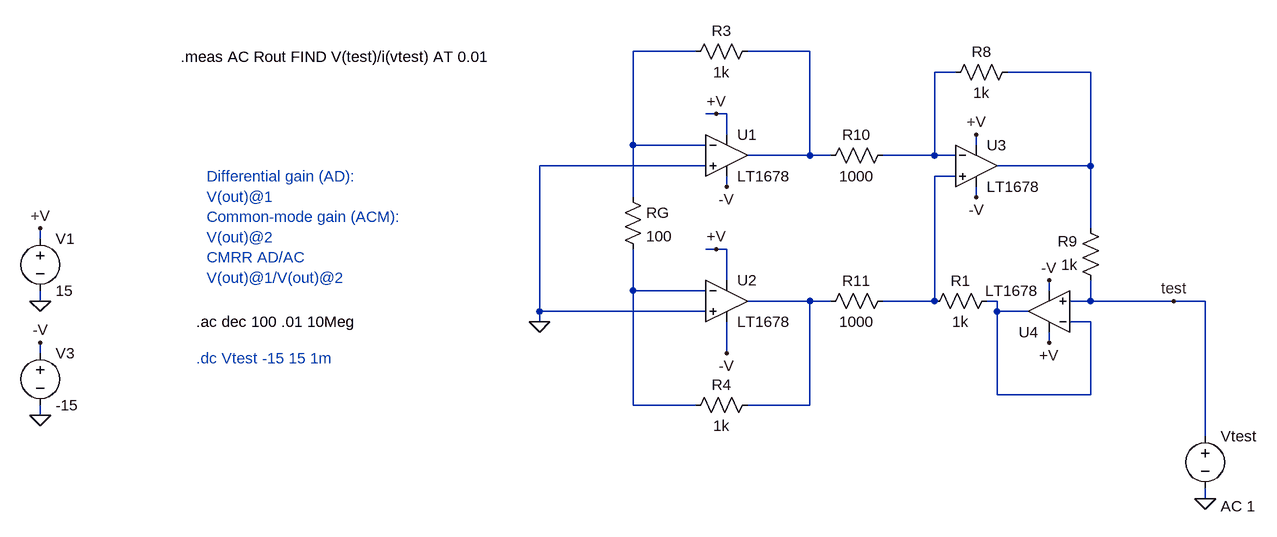
[diagram p0: schematic AI_VI_Buffer_Rout.asc]
AI_VI_Buffer_Rout.asc, the LTspice schematic file:
Version 4
SHEET 1 2004 1572
WIRE 416 48 320 48
WIRE 592 48 496 48
WIRE 816 80 784 80
WIRE 1024 80 896 80
WIRE 448 144 432 144
WIRE 464 144 448 144
WIRE 464 176 464 144
WIRE 320 192 320 48
WIRE 432 192 320 192
WIRE 848 192 848 176
WIRE 592 208 592 48
WIRE 592 208 496 208
WIRE 624 208 592 208
WIRE 784 208 784 80
WIRE 784 208 704 208
WIRE 816 208 784 208
WIRE 432 224 176 224
WIRE 1024 224 1024 80
WIRE 1024 224 880 224
WIRE 816 240 784 240
WIRE 464 256 464 240
WIRE 320 272 320 192
WIRE 848 272 848 256
WIRE 1024 320 1024 224
WIRE -592 336 -592 320
WIRE 448 352 432 352
WIRE 464 352 448 352
WIRE 464 400 464 352
WIRE 320 416 320 352
WIRE 432 416 320 416
WIRE 960 416 960 400
WIRE -592 432 -592 416
WIRE 592 432 496 432
WIRE 624 432 592 432
WIRE 784 432 784 240
WIRE 784 432 704 432
WIRE 880 432 864 432
WIRE 1024 432 1024 400
WIRE 1024 432 992 432
WIRE 1152 432 1024 432
WIRE 1200 432 1152 432
WIRE 176 448 176 224
WIRE 432 448 176 448
WIRE 880 448 880 432
WIRE 928 448 880 448
WIRE 176 464 176 448
WIRE 1024 464 992 464
WIRE 960 496 960 480
WIRE -592 512 -592 496
WIRE 464 512 464 464
WIRE 880 576 880 448
WIRE 1024 576 1024 464
WIRE 1024 576 880 576
WIRE 320 592 320 416
WIRE 416 592 320 592
WIRE 592 592 592 432
WIRE 592 592 496 592
WIRE -592 608 -592 592
WIRE 1200 640 1200 432
WIRE 1200 736 1200 720
FLAG -592 432 0
FLAG -592 608 0
FLAG -592 320 +V
FLAG -592 496 -V
FLAG 448 144 +V
FLAG 464 512 -V
FLAG 848 176 +V
FLAG 848 272 -V
FLAG 448 352 +V
FLAG 464 256 -V
FLAG 1200 736 0
FLAG 960 496 +V
FLAG 960 400 -V
FLAG 1152 432 test
FLAG 176 464 0
DATAFLAG 320 192 ""
SYMBOL Opamps\\LT1678 848 224 R0
SYMATTR InstName U3
SYMBOL voltage -592 320 R0
WINDOW 123 0 0 Left 2
WINDOW 39 0 0 Left 2
SYMATTR InstName V1
SYMATTR Value 15
SYMBOL voltage -592 496 R0
WINDOW 123 0 0 Left 2
WINDOW 39 0 0 Left 2
SYMATTR InstName V3
SYMATTR Value -15
SYMBOL res 912 64 R90
WINDOW 0 0 56 VBottom 2
WINDOW 3 32 56 VTop 2
SYMATTR InstName R8
SYMATTR Value 1k
SYMATTR SpiceLine tol=1 pwr=0.1
SYMBOL res 1040 416 R180
WINDOW 0 36 76 Left 2
WINDOW 3 36 40 Left 2
SYMATTR InstName R9
SYMATTR Value 1k
SYMATTR SpiceLine tol=1 pwr=0.1
SYMBOL res 720 192 R90
WINDOW 0 0 56 VBottom 2
WINDOW 3 32 56 VTop 2
SYMATTR InstName R10
SYMATTR Value 1000
SYMATTR SpiceLine tol=1 pwr=0.1
SYMBOL res 720 416 R90
WINDOW 0 0 56 VBottom 2
WINDOW 3 32 56 VTop 2
SYMATTR InstName R11
SYMATTR Value 1000
SYMATTR SpiceLine tol=1 pwr=0.1
SYMBOL res 304 256 R0
SYMATTR InstName RG
SYMATTR Value 100
SYMATTR SpiceLine tol=1 pwr=0.1
SYMBOL res 512 32 R90
WINDOW 0 0 56 VBottom 2
WINDOW 3 32 56 VTop 2
SYMATTR InstName R3
SYMATTR Value 1k
SYMATTR SpiceLine tol=1 pwr=0.1
SYMBOL res 512 576 R90
WINDOW 0 0 56 VBottom 2
WINDOW 3 32 56 VTop 2
SYMATTR InstName R4
SYMATTR Value 1k
SYMATTR SpiceLine tol=1 pwr=0.1
SYMBOL Opamps\\LT1678 464 208 R0
SYMATTR InstName U1
SYMBOL Opamps\\LT1678 464 432 R0
SYMATTR InstName U2
SYMBOL Opamps\\LT1678 960 448 R180
SYMATTR InstName U4
SYMBOL voltage 1200 624 R0
WINDOW 123 24 124 Left 2
WINDOW 39 0 0 Left 2
SYMATTR Value2 AC 1
SYMATTR InstName Vtest
SYMATTR Value ""
SYMBOL res 880 416 R90
WINDOW 0 0 56 VBottom 2
WINDOW 3 32 56 VTop 2
SYMATTR InstName R1
SYMATTR Value 1k
SYMATTR SpiceLine tol=1 pwr=0.1
TEXT -352 464 Left 2 !.ac dec 100 .01 10Meg
TEXT -376 56 Left 2 !.meas AC Rout FIND V(test)/i(vtest) AT 0.01
TEXT -336 240 Left 2 ;Differential gain (AD):\nV(out)@1\nCommon-mode gain (ACM):\nV(out)@2\nCMRR AD/AC\nV(out)@1/V(out)@2
TEXT -352 520 Left 2 ;.dc Vtest -15 15 1m

The netlist it stands for:
* AI_VI_Buffer_Rout.asc
XU3 N005 N003 N004 +V -V LT1678  ; pins In+ In- OUT V+ V-
V1 +V 0 15
V3 -V 0 -15
R8 N004 N003 1k tol=1 pwr=0.1
R9 test N004 1k tol=1 pwr=0.1
R10 N003 N002 1000 tol=1 pwr=0.1
R11 N005 N007 1000 tol=1 pwr=0.1
RG N001 N006 100 tol=1 pwr=0.1
R3 N002 N001 1k tol=1 pwr=0.1
R4 N007 N006 1k tol=1 pwr=0.1
XU1 0 N001 N002 +V -V LT1678  ; pins In+ In- OUT V+ V-
XU2 0 N006 N007 +V -V LT1678  ; pins In+ In- OUT V+ V-
XU4 test N008 N008 +V -V LT1678  ; pins In+ In- OUT V+ V-
Vtest test 0 AC 1
R1 N008 N005 1k tol=1 pwr=0.1
.ac dec 100 .01 10Meg
.meas AC Rout FIND V(test)/i(vtest) AT 0.01
* Differential gain (AD):
* V(out)@1
* Common-mode gain (ACM):
* V(out)@2
* CMRR AD/AC
* V(out)@1/V(out)@2
* .dc Vtest -15 15 1m
.backanno
.end